# EAGLE design Pots (EAGLE 7.4.0)
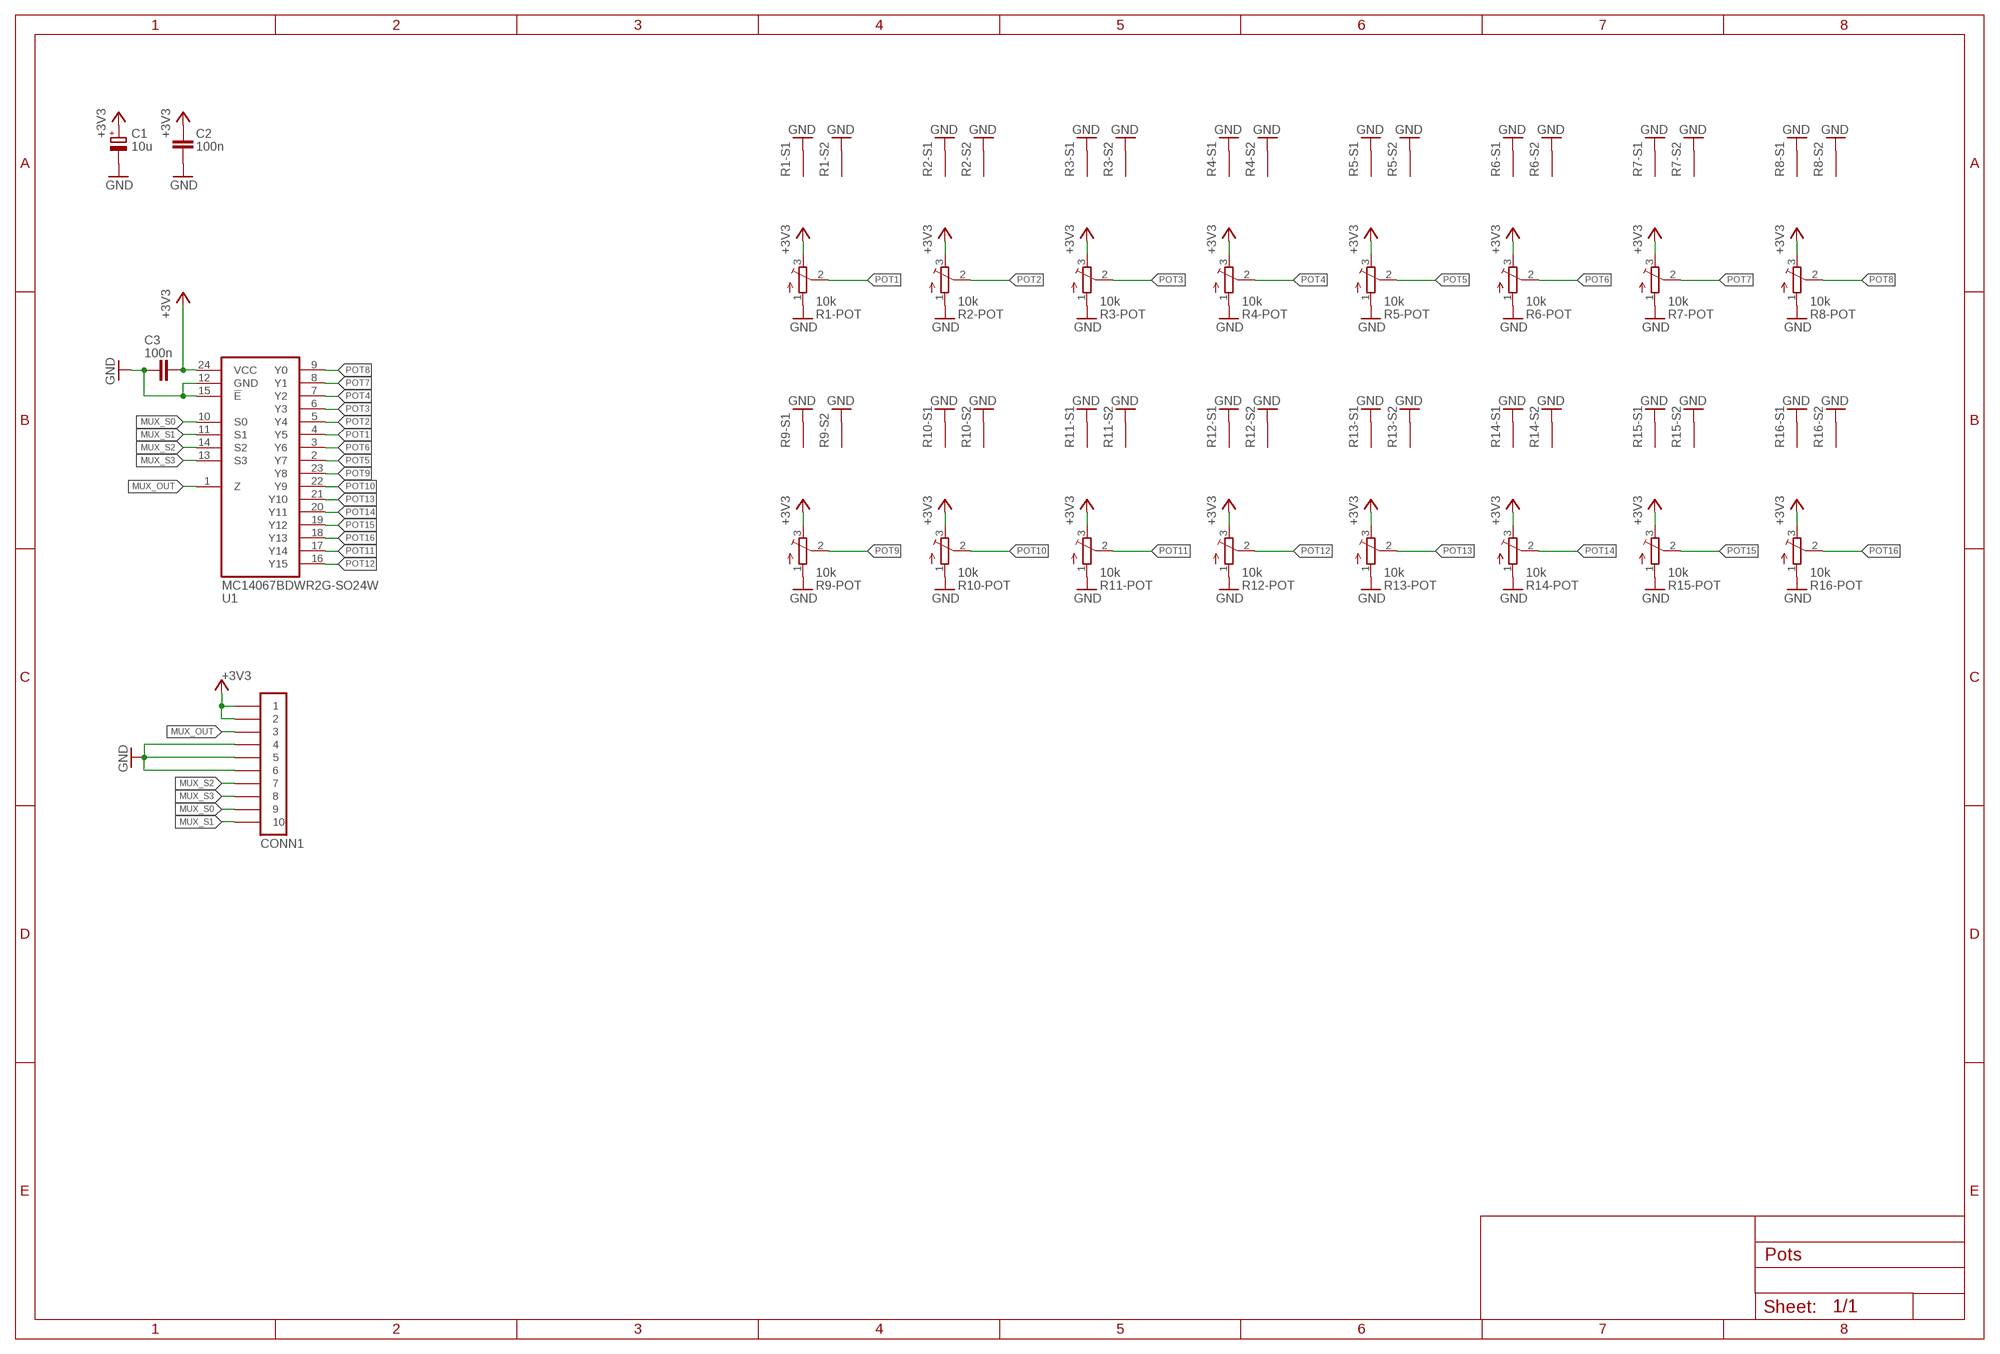
[diagram p0: schematic, sheet 1]

## Parts
C1  10u  ELECTROLYTIC_CAPACITOR16V-CLV-0405  [153CLV-0405]
C2  100n  CAPACITOR-0805  [C0805]
C3  100n  CAPACITOR-0805  [C0805]
CONN1  PINHD-1X10-FFC-1MM-Z  [MOLEX-52271-1079]
R1  10k  PTV09A-4025F-B103  [PTV09A-4025F-B103]
R2  10k  PTV09A-4025F-B103  [PTV09A-4025F-B103]
R3  10k  PTV09A-4025F-B103  [PTV09A-4025F-B103]
R4  10k  PTV09A-4025F-B103  [PTV09A-4025F-B103]
R5  10k  PTV09A-4025F-B103  [PTV09A-4025F-B103]
R6  10k  PTV09A-4025F-B103  [PTV09A-4025F-B103]
R7  10k  PTV09A-4025F-B103  [PTV09A-4025F-B103]
R8  10k  PTV09A-4025F-B103  [PTV09A-4025F-B103]
R9  10k  PTV09A-4025F-B103  [PTV09A-4025F-B103]
R10  10k  PTV09A-4025F-B103  [PTV09A-4025F-B103]
R11  10k  PTV09A-4025F-B103  [PTV09A-4025F-B103]
R12  10k  PTV09A-4025F-B103  [PTV09A-4025F-B103]
R13  10k  PTV09A-4025F-B103  [PTV09A-4025F-B103]
R14  10k  PTV09A-4025F-B103  [PTV09A-4025F-B103]
R15  10k  PTV09A-4025F-B103  [PTV09A-4025F-B103]
R16  10k  PTV09A-4025F-B103  [PTV09A-4025F-B103]
U1  MC14067BDWR2G-SO24W  [SO24-W]

## Nets
+3V3: C1.+ C2.1 C3.2 CONN1.1 CONN1.2 R1.3 R2.3 R3.3 R4.3 R5.3 R6.3 R7.3 R8.3 R9.3 R10.3 R11.3 R12.3 R13.3 R14.3 R15.3 R16.3 U1.24(VCC)
GND: C1.- C2.2 C3.1 CONN1.4 CONN1.5 CONN1.6 R1.1 R1.S1(-S1:S) R1.S2(-S2:S) R2.1 R2.S1(-S1:S) R2.S2(-S2:S) R3.1 R3.S1(-S1:S) R3.S2(-S2:S) R4.1 R4.S1(-S1:S) R4.S2(-S2:S) R5.1 R5.S1(-S1:S) R5.S2(-S2:S) R6.1 R6.S1(-S1:S) R6.S2(-S2:S) R7.1 R7.S1(-S1:S) R7.S2(-S2:S) R8.1 R8.S1(-S1:S) R8.S2(-S2:S) R9.1 R9.S1(-S1:S) R9.S2(-S2:S) R10.1 R10.S1(-S1:S) R10.S2(-S2:S) R11.1 R11.S1(-S1:S) R11.S2(-S2:S) R12.1 R12.S1(-S1:S) R12.S2(-S2:S) R13.1 R13.S1(-S1:S) R13.S2(-S2:S) R14.1 R14.S1(-S1:S) R14.S2(-S2:S) R15.1 R15.S1(-S1:S) R15.S2(-S2:S) R16.1 R16.S1(-S1:S) R16.S2(-S2:S) U1.12(GND) U1.15(!E)
MUX_OUT: CONN1.3 U1.1(Z)
MUX_S0: CONN1.9 U1.10(S0)
MUX_S1: CONN1.10 U1.11(S1)
MUX_S2: CONN1.7 U1.14(S2)
MUX_S3: CONN1.8 U1.13(S3)
POT1: R1.2 U1.4(Y5)
POT2: R2.2 U1.5(Y4)
POT3: R3.2 U1.6(Y3)
POT4: R4.2 U1.7(Y2)
POT5: R5.2 U1.2(Y7)
POT6: R6.2 U1.3(Y6)
POT7: R7.2 U1.8(Y1)
POT8: R8.2 U1.9(Y0)
POT9: R9.2 U1.23(Y8)
POT10: R10.2 U1.22(Y9)
POT11: R11.2 U1.17(Y14)
POT12: R12.2 U1.16(Y15)
POT13: R13.2 U1.21(Y10)
POT14: R14.2 U1.20(Y11)
POT15: R15.2 U1.19(Y12)
POT16: R16.2 U1.18(Y13)

## Library data of the parts
C1 = igor_lbr:ELECTROLYTIC_CAPACITOR: Electrolytic capacitor; MANUFACTURER: Multicomp; MPN: MCVVT016M100CA1L
C2 C3 = igor_lbr:CAPACITOR: Capacitor
CONN1 = igor_lbr:PINHD-1X10: Pin header
R1-R16 = igor_lbr:PTV09A-4025F-B103: Potentiometer
U1 = igor_lbr:MC14067BDWR2G: 16-Channel Analog Multiplexer/Demultiplexer; MANUFACTURER: ON Semiconductor; MPN: MC14067BDWR2G

## Board
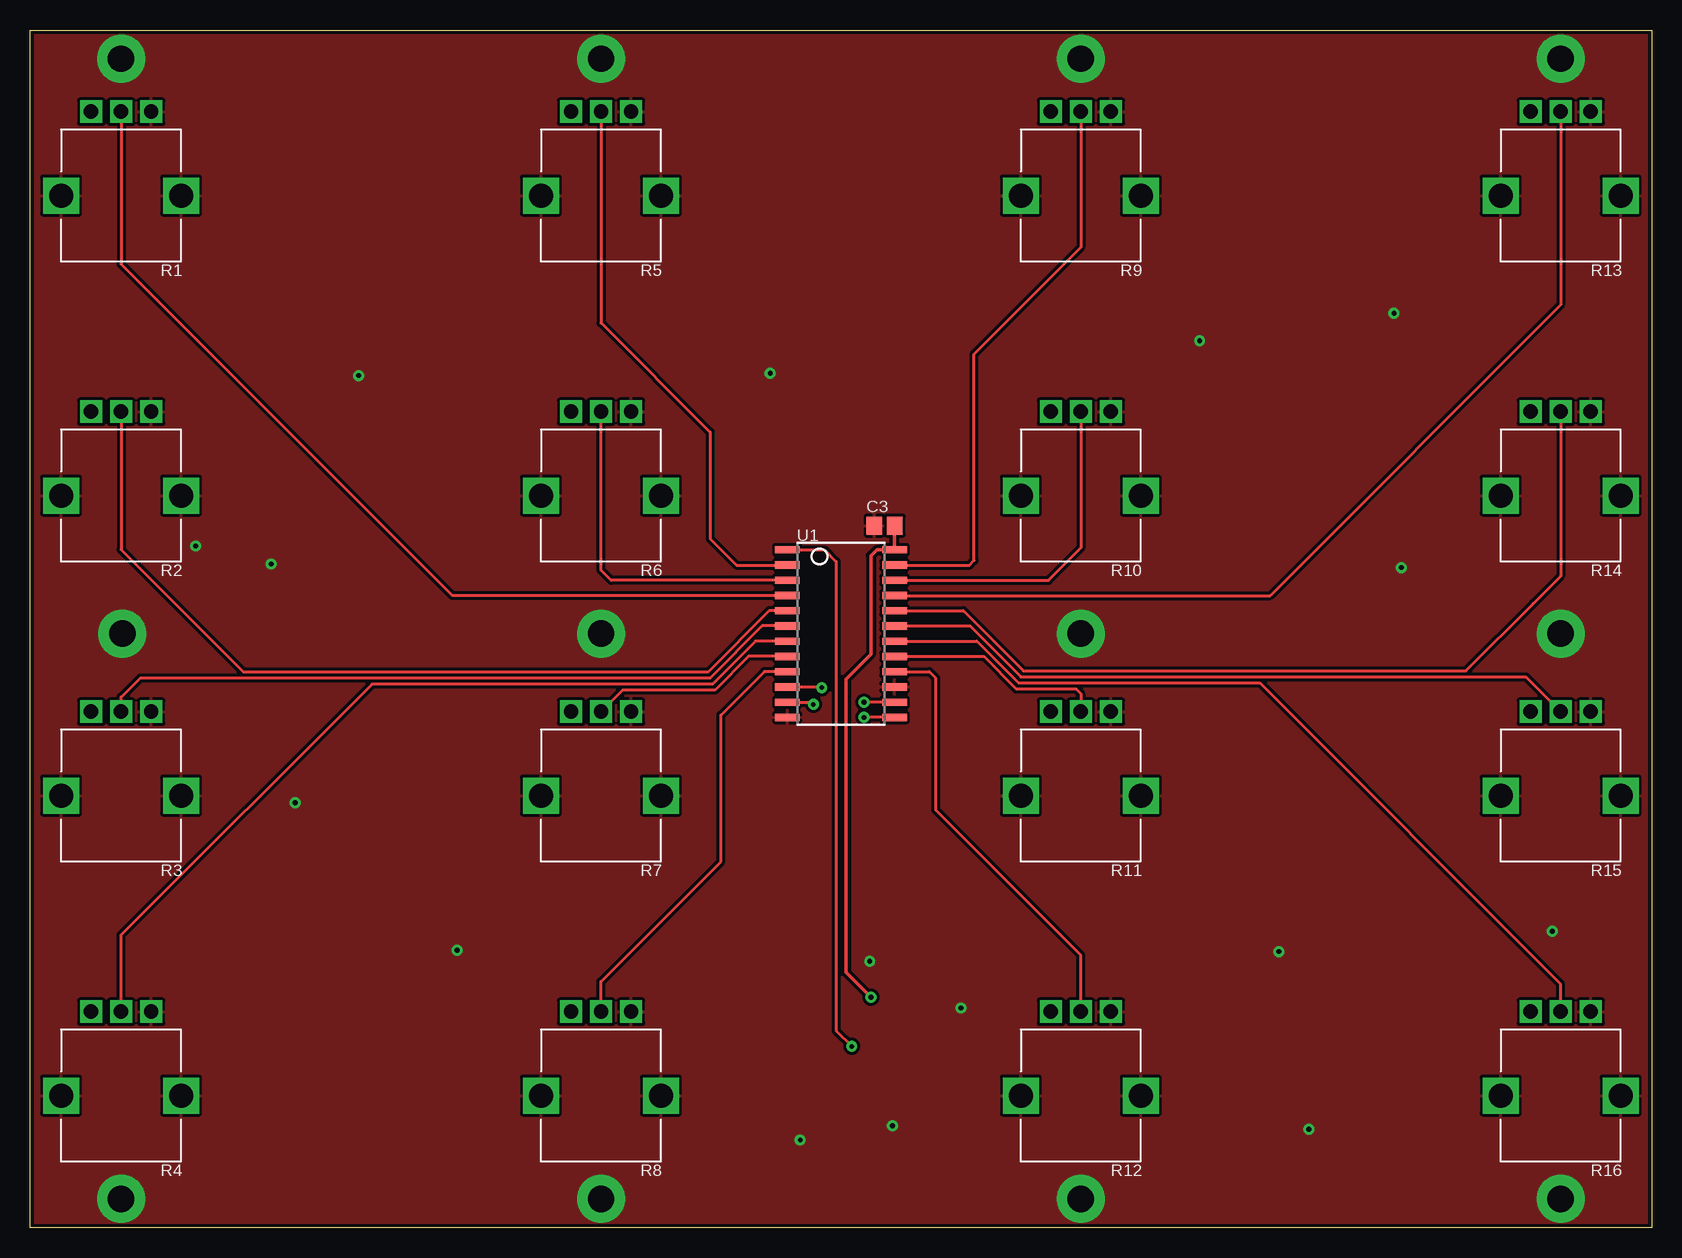
[diagram p1: board, top side]
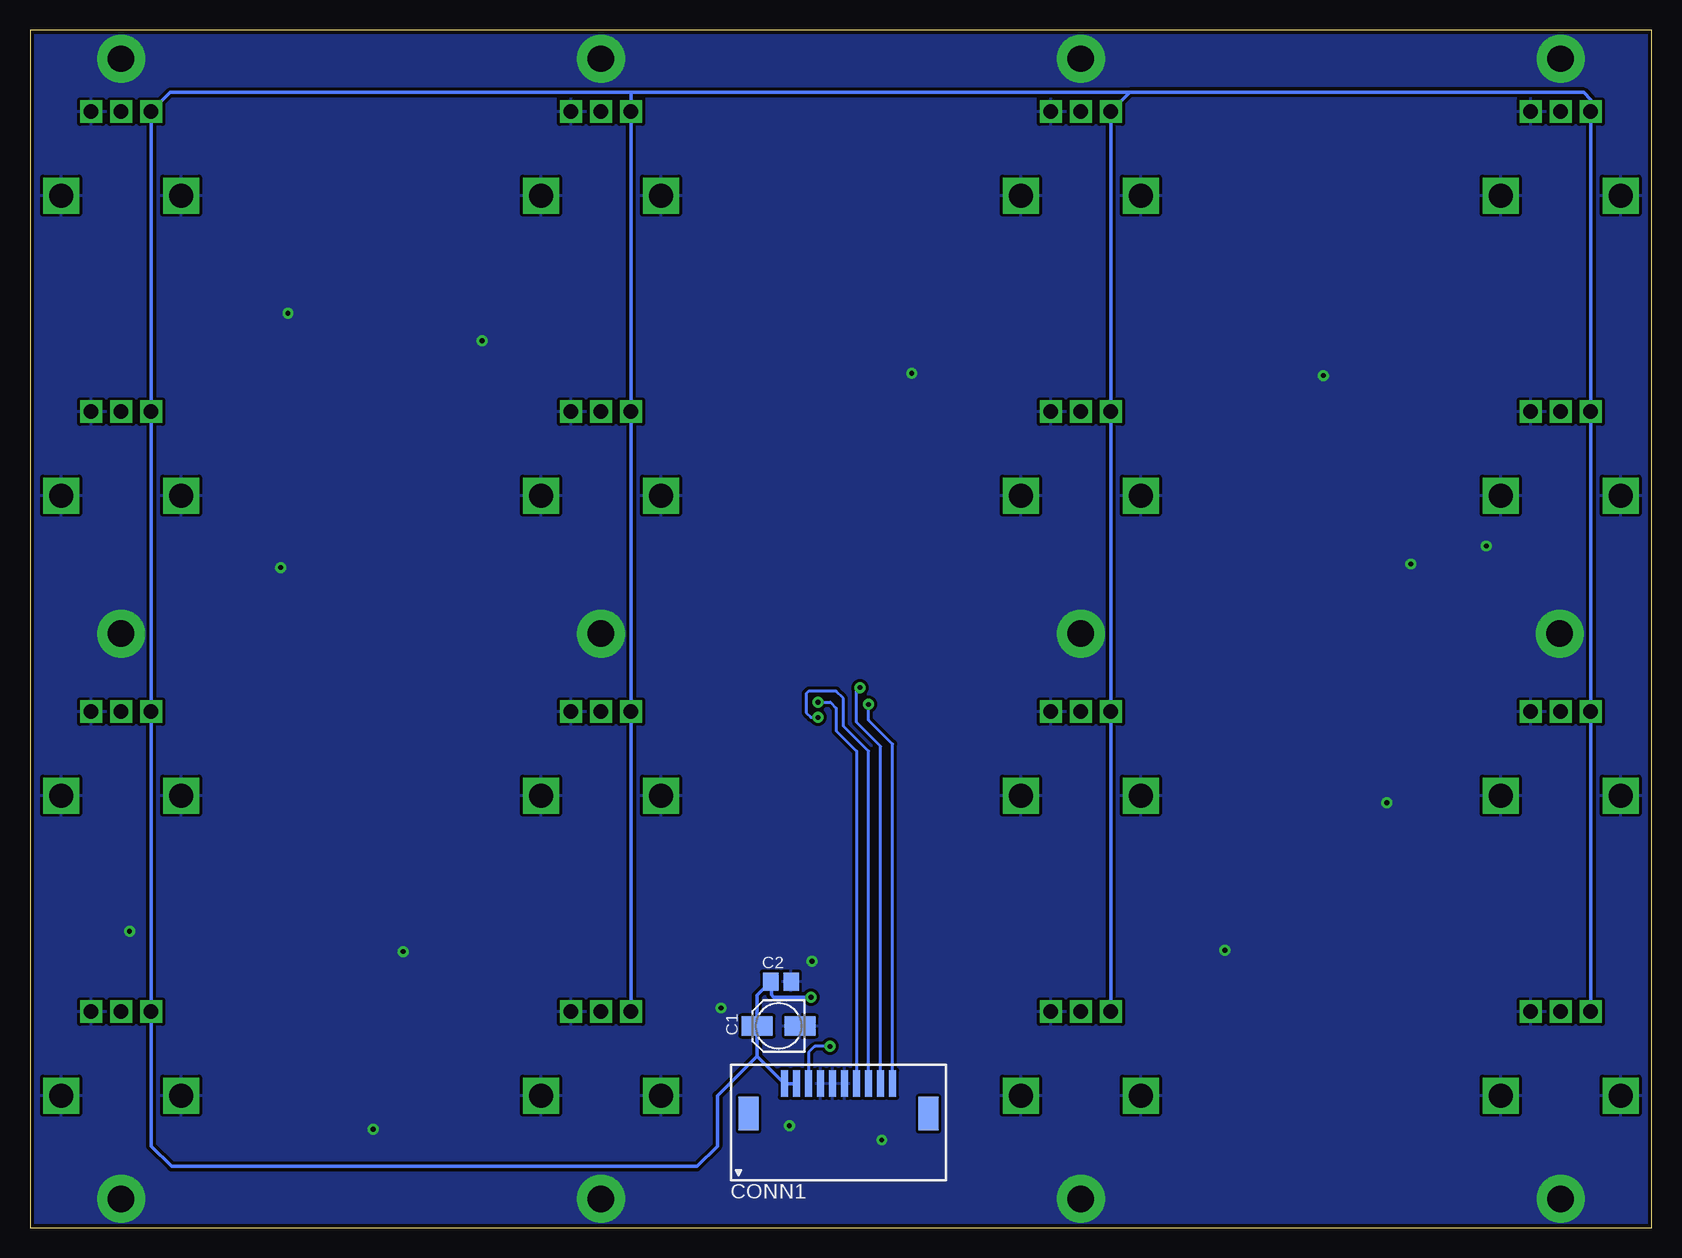
[diagram p2: board, bottom side, seen from below]

Size 135.2 x 99.8 mm. Coordinates in mm from the lower left corner, seen from the top.
Outline: 0,99.8 135.2,99.8 135.2,0 0,0 0,99.8
Copper layers (1*16): Top 0.035mm / dielectric 1.5mm / Bottom 0.035mm
Design rules "smiery": minimum track width 10mil, minimum drill 12mil, track to track 7mil, track to pad 5mil, pad to pad 5mil, via to via 6mil, smd to smd 0mil, copper to edge 12mil, drill to drill 10mil, minimum pad ring 13mil, minimum via ring 10mil, stop-mask expansion 2mil, vias tented up to drill 25mil, thermal gap 10mil

### Footprints (pad centres in the part's own frame; a part is rotated, then mirrored left to right if it is on the bottom)
153CLV-0405 = smd 2.6 x 1.6: + 1.8,0; - -1.8,0
C0805 = smd 1.3 x 1.5: 1 -0.85,0; 2 0.85,0
MOLEX-52271-1079 = smd 0.6 x 2.2: 1 -4.5,3.5; 2 -3.5,3.5; 3 -2.5,3.5; 4 -1.5,3.5; 5 -0.5,3.5; 6 0.5,3.5; 7 1.5,3.5; 8 2.5,3.5; 9 3.5,3.5; 10 4.5,3.5 | smd 1.65 x 2.8: S1 -7.5,1; S2 7.5,1
PTV09A-4025F-B103 = drill 1.2 square: 1 -2.5,-7; 2 0,-7; 3 2.5,-7 | drill 2 square: S1 -5,0; S2 5,0
SO24-W = smd 2.032 x 0.6: 1 -4.475,6.985; 2 -4.475,5.715; 3 -4.475,4.445; 4 -4.475,3.175; 5 -4.475,1.905; 6 -4.475,0.635; 7 -4.475,-0.635; 8 -4.475,-1.905; 9 -4.475,-3.175; 10 -4.475,-4.445; 11 -4.475,-5.715; 12 -4.475,-6.985; 13 4.475,-6.985; 14 4.475,-5.715; 15 4.475,-4.445; 16 4.475,-3.175; 17 4.475,-1.905; 18 4.475,-0.635; 19 4.475,0.635; 20 4.475,1.905; 21 4.475,3.175; 22 4.475,4.445; 23 4.475,5.715; 24 4.475,6.985

### Placement (x,y rotation side)
C1  72.8,16.8 180 bottom
C2  72.6,20.5 0 bottom
C3  71.23,58.49 0 top
CONN1  67.8,8.5 0 bottom
R1  7.6,86 180 top
R2  7.6,61 180 top
R3  7.6,36 180 top
R4  7.6,11 180 top
R5  47.6,86 180 top
R6  47.6,61 180 top
R7  47.6,36 180 top
R8  47.6,11 180 top
R9  87.6,86 180 top
R10  87.6,61 180 top
R11  87.6,36 180 top
R12  87.6,11 180 top
R13  127.6,86 180 top
R14  127.6,61 180 top
R15  127.6,36 180 top
R16  127.6,11 180 top
U1  67.6,49.5 0 top

### Tracks (layer width: path | path; a pad name or v marks a point on that pad's centre or on a via)
+3V3  (via drill 0.4 pad 0.6)
  Top 0.305: C3.2 U1.24 70.58,56.48 70.1,56 70.1,47.8 68,45.7 68,21.3 v70.1,19.2
  Bottom 0.305: 74.6,14.3 C1.+ 74.6,19.35 C2.1 73.4,20.45 73.4,19.4 73.2,19.2 v70.1,19.2 | 74.6,14.3 CONN1.1 CONN1.2 | 74.6,14.3 77.9,11 77.9,6.8 79.6,5.1 123.4,5.1 125.1,6.8 R16.3 R15.3 R14.3 R13.3 123.5,94.6 85.1,94.6 | R4.3 R3.3 R2.3 R1.3 5.1,94 5.7,94.6 43.5,94.6 | R8.3 R7.3 R6.3 R5.3 43.5,94.6 | R12.3 R11.3 R10.3 R9.3 85.1,94.6 | 85.1,94.6 43.5,94.6
GND  (via drill 0.4 pad 0.6, 2.2 pad 4)
  other vias: 35.6,23.1 13.8,56.8 7.6,97.4 47.6,97.4 7.7,49.5 47.6,49.5 47.6,2.4 7.6,2.4 87.6,97.4 127.6,97.4 87.6,49.5 127.6,49.5 87.6,2.4 127.6,2.4 22.1,35.4 20.1,55.3 27.4,71 61.7,71.2 97.5,73.9 113.7,76.2 104.1,23 106.6,8.2 114.3,55 126.9,24.7 71.9,8.5 64.2,7.3 77.6,18.3 70,22.2
  pour Top (isolate 0.254): 0,99.8 135.2,99.8 135.2,0 0,0
  pour Bottom (isolate 0.254): 0,99.8 135.2,99.8 135.2,0 0,0
MUX_OUT  (via drill 0.4 pad 0.6)
  Top 0.254: U1.1 66.22,56.48 67.2,55.5 67.2,16.4 v68.5,15.1
  Bottom 0.254: v68.5,15.1 69.8,15.1 70.3,14.6 CONN1.3
MUX_S0  (via drill 0.4 pad 0.6)
  Top 0.254: U1.10 65.94,45.05 v66,45
  Bottom 0.254: CONN1.9 64.3,40.1 66.3,42.1 66.3,44.7 v66,45
MUX_S1  (via drill 0.4 pad 0.6)
  Top 0.254: U1.11 65.11,43.78 v65.3,43.6
  Bottom 0.254: CONN1.10 63.3,40.3 65.3,42.3 v65.3,43.6
MUX_S2  (via drill 0.4 pad 0.6)
  Top 0.254: U1.14 v69.52,43.78
  Bottom 0.254: v69.52,43.78 68.48,43.78 68,43.3 68,41.4 66.3,39.7 CONN1.7
MUX_S3  (via drill 0.4 pad 0.6)
  Top 0.254: U1.13 v69.52,42.52
  Bottom 0.254: CONN1.8 65.3,39.7 67.4,41.8 67.4,44.1 68,44.7 70.3,44.7 70.5,44.5 70.5,42.91 70.1,42.52 v69.52,42.52
POT1
  Top 0.254: U1.4 35.23,52.67 7.6,80.3 R1.2
POT2
  Top 0.254: U1.5 61.6,51.41 56.5,46.3 17.8,46.3 7.6,56.5 R2.2
POT3
  Top 0.254: U1.6 61.03,50.13 56.7,45.8 9.2,45.8 7.6,44.2 R3.2
POT4
  Top 0.254: U1.7 60.47,48.87 56.9,45.3 28.5,45.3 7.6,24.4 R4.2
POT5
  Top 0.254: U1.2 63.11,55.2 58.9,55.2 56.7,57.4 56.7,66.3 47.6,75.4 R5.2
POT6
  Top 0.254: U1.3 48.45,53.95 47.6,54.8 R6.2
POT7
  Top 0.254: U1.8 59.9,47.59 57.1,44.8 49.4,44.8 R7.2
POT8
  Top 0.254: U1.9 61.23,46.33 57.6,42.7 57.6,30.5 47.6,20.5 R8.2
POT9
  Top 0.254: U1.23 78.31,55.22 78.7,55.6 78.7,72.8 87.6,81.7 R9.2
POT10
  Top 0.254: U1.22 84.9,53.95 87.6,56.65 R10.2
POT11
  Top 0.254: U1.17 79.5,47.6 82.2,44.9 87.2,44.9 87.6,44.5 R11.2
POT12
  Top 0.254: R12.2 87.6,22.7 75.5,34.8 75.5,45.8 74.97,46.33 U1.16
POT13
  Top 0.254: U1.21 103.38,52.67 127.6,76.9 R13.2
POT14
  Top 0.254: U1.20 77.8,51.41 82.8,46.4 119.7,46.4 125.3,52 127.6,54.3 R14.2
POT15
  Top 0.254: U1.19 78.36,50.13 82.6,45.9 124.7,45.9 R15.2
POT16
  Top 0.254: U1.18 78.94,48.87 82.4,45.4 102.5,45.4 127.6,20.3 R16.2